# Altium schematic sheet CUVET_DECTECT_POWER.SchDoc
size A; SheetNumber: 9; SheetTotal: 9
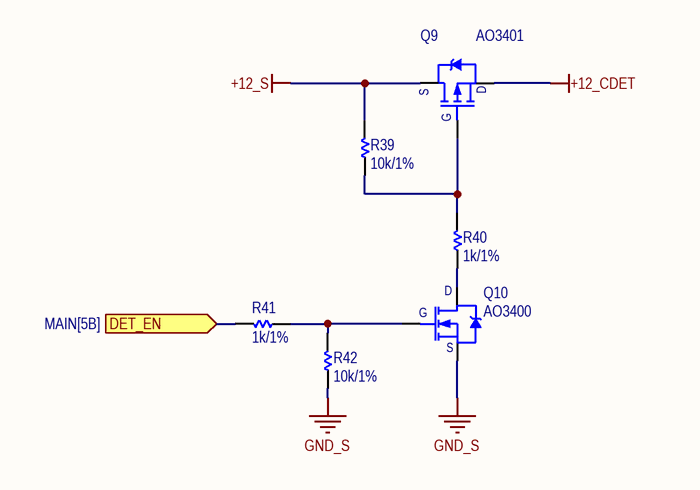
[diagram p0: CUVET_DECTECT_POWER.SchDoc]

## Parts
Q9  AO3401  [SOT23-123]
Q10  AO3400  [SOT23-123]
R39  10k/1%  [RES-SMD-0603]
R40  1k/1%  [RES-SMD-0603]
R41  1k/1%  [RES-SMD-0603]
R42  10k/1%  [RES-SMD-0603]

## Ports
DET_EN (in, see MAIN[5B])

## Nets
+12_CDET: Q9.2(D)
+12_S: Q9.3(S) R39.1
GND_S: Q10.3(S) R42.2
DET_EN: R41.1 ; port DET_EN
NetQ9_1: Q9.1(G) R39.2 R40.1
NetQ10_1: Q10.1(G) R41.2 R42.1
NetQ10_2: Q10.2(D) R40.2

## Library data of the parts
Q9 = AO3401: P-MOS 30V 4A
Q10 = AO3400: N-MOS 30V 5.8A
R39 R42 = Res-SMD: ERJ-3EKF1002V; Manufacturer: Generic Components; Class: Passive; PN: ERJ-3EKF1002V; Publisher: Altium Hobart Technology Centre
R40 R41 = Res-SMD: ERJ-3EKF1001V; Manufacturer: Generic Components; Class: Passive; PN: ERJ-3EKF1001V; Publisher: Altium Hobart Technology Centre